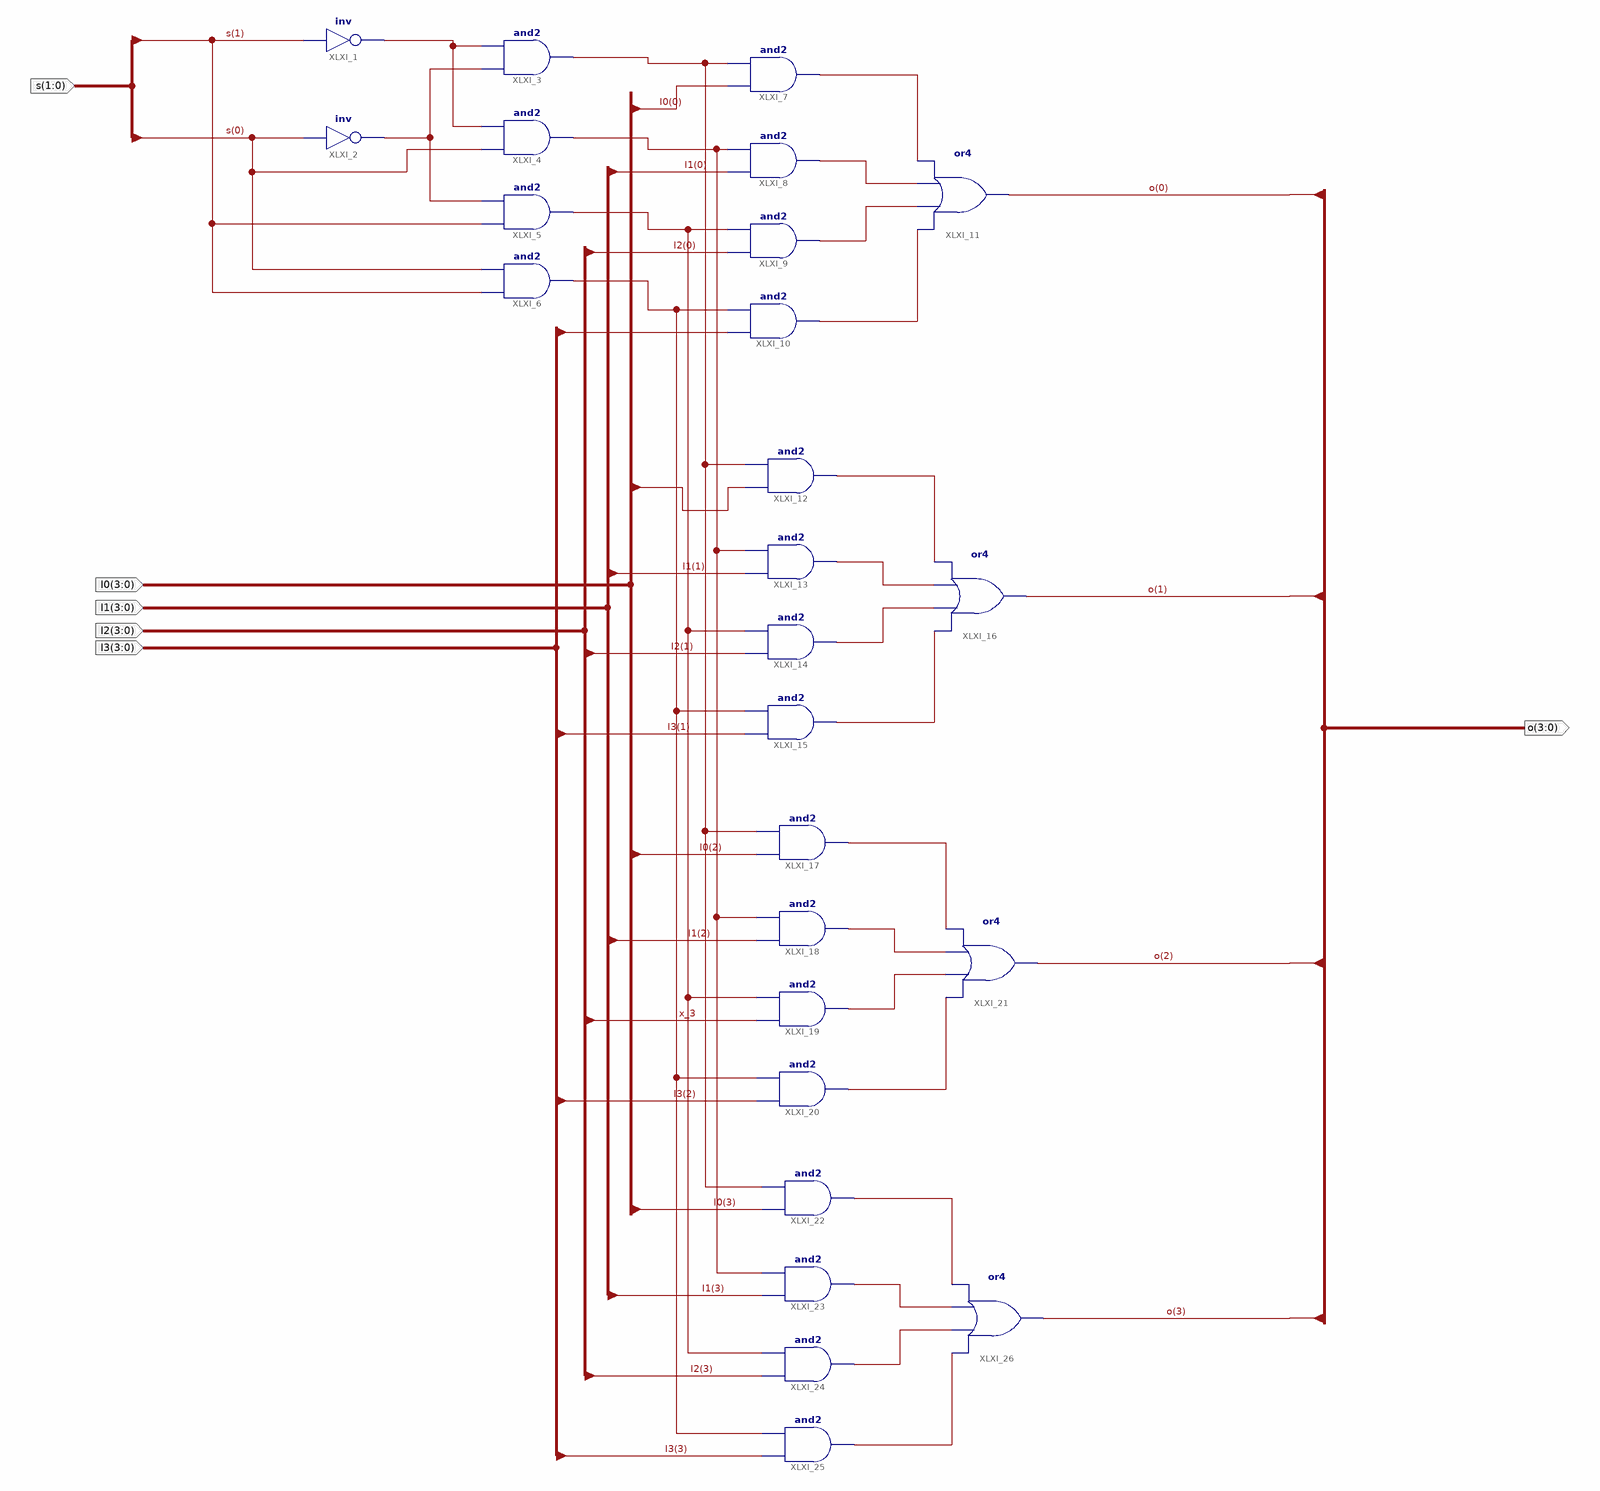
[diagram p0: schematic sheet 1]
// Xilinx ISE schematic MUX4T1_4.sch (kintex7) as structural Verilog: 26 symbols, 6 ports
module MUX4T1_4 (
  input  [1:0] s,
  input  [3:0] I1,
  input  [3:0] I2,
  input  [3:0] I3,
  input  [3:0] I0,
  output [3:0] o
);

  wire x_3, x_22, XLXN_6, XLXN_7, XLXN_32, XLXN_33, XLXN_34, XLXN_35, XLXN_38, XLXN_39, XLXN_40, XLXN_41,
       XLXN_43, XLXN_44, XLXN_45, XLXN_46, XLXN_48, XLXN_49, XLXN_50, XLXN_51, XLXN_62, XLXN_120;

  not XLXI_1 (XLXN_6, s[1]);
  not XLXI_2 (XLXN_7, s[0]);
  and XLXI_3 (x_22, XLXN_7, XLXN_6);
  and XLXI_4 (XLXN_120, s[0], XLXN_6);
  and XLXI_5 (x_3, s[1], XLXN_7);
  and XLXI_6 (XLXN_62, s[1], s[0]);
  and XLXI_7 (XLXN_32, I0[0], x_22);
  and XLXI_8 (XLXN_33, I1[0], XLXN_120);
  and XLXI_9 (XLXN_34, I2[0], x_3);
  and XLXI_10 (XLXN_35, I3[0], XLXN_62);
  or XLXI_11 (o[0], XLXN_35, XLXN_34, XLXN_33, XLXN_32);
  and XLXI_12 (XLXN_38, I0[1], x_22);
  and XLXI_13 (XLXN_39, I1[1], XLXN_120);
  and XLXI_14 (XLXN_40, I2[1], x_3);
  and XLXI_15 (XLXN_41, I3[1], XLXN_62);
  or XLXI_16 (o[1], XLXN_41, XLXN_40, XLXN_39, XLXN_38);
  and XLXI_17 (XLXN_43, I0[2], x_22);
  and XLXI_18 (XLXN_44, I1[2], XLXN_120);
  and XLXI_19 (XLXN_45, I2[2], x_3);
  and XLXI_20 (XLXN_46, I3[2], XLXN_62);
  or XLXI_21 (o[2], XLXN_46, XLXN_45, XLXN_44, XLXN_43);
  and XLXI_22 (XLXN_48, I0[3], x_22);
  and XLXI_23 (XLXN_49, I1[3], XLXN_120);
  and XLXI_24 (XLXN_50, I2[3], x_3);
  and XLXI_25 (XLXN_51, I3[3], XLXN_62);
  or XLXI_26 (o[3], XLXN_51, XLXN_50, XLXN_49, XLXN_48);
endmodule
